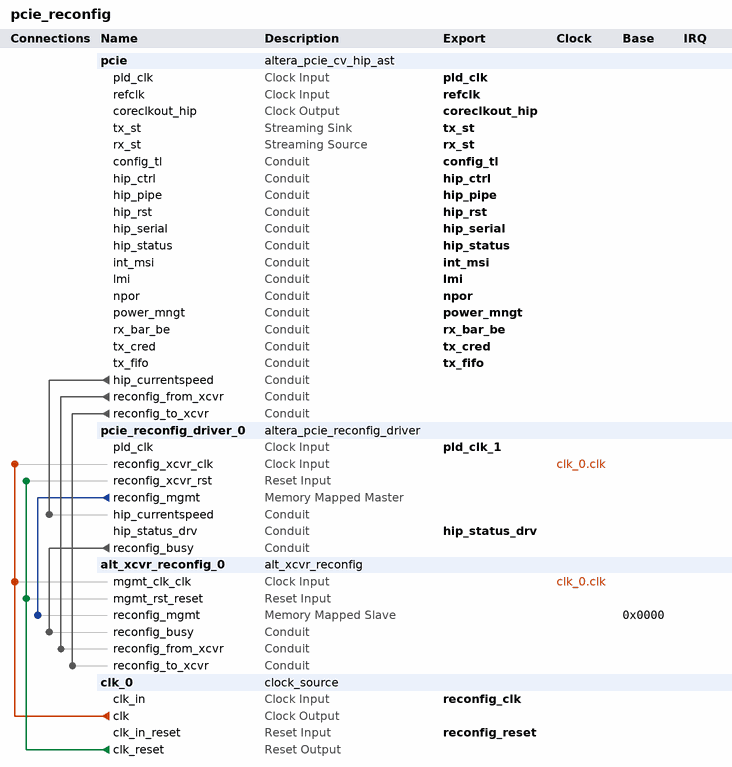
[diagram p0: system contents]
# Platform Designer (Qsys) system pcie_reconfig, Cyclone V 5CGXFC7D7F31C8
# Parameters at their usual value, and those the tool derives, are not listed.
package require -exact qsys 16.1
create_system pcie_reconfig
set_project_property DEVICE_FAMILY {Cyclone V}
set_project_property DEVICE 5CGXFC7D7F31C8

add_instance pcie altera_pcie_cv_hip_ast 16.1
set_instance_parameter_value pcie ACDS_VERSION_HWTCL 15.0
set_instance_parameter_value pcie advanced_default_parameter_override 0
set_instance_parameter_value pcie altpcie_avmm_hwtcl 0
set_instance_parameter_value pcie ast_width_hwtcl {Avalon-ST 64-bit}
set_instance_parameter_value pcie bar0_size_mask_0_hwtcl 7
set_instance_parameter_value pcie bar0_size_mask_1_hwtcl 28
set_instance_parameter_value pcie bar0_size_mask_2_hwtcl 28
set_instance_parameter_value pcie bar0_size_mask_3_hwtcl 28
set_instance_parameter_value pcie bar0_size_mask_4_hwtcl 28
set_instance_parameter_value pcie bar0_size_mask_5_hwtcl 28
set_instance_parameter_value pcie bar0_size_mask_6_hwtcl 28
set_instance_parameter_value pcie bar0_size_mask_7_hwtcl 28
set_instance_parameter_value pcie bar0_type_0_hwtcl 1
set_instance_parameter_value pcie bar0_type_1_hwtcl 1
set_instance_parameter_value pcie bar0_type_2_hwtcl 1
set_instance_parameter_value pcie bar0_type_3_hwtcl 1
set_instance_parameter_value pcie bar0_type_4_hwtcl 1
set_instance_parameter_value pcie bar0_type_5_hwtcl 1
set_instance_parameter_value pcie bar0_type_6_hwtcl 1
set_instance_parameter_value pcie bar0_type_7_hwtcl 1
set_instance_parameter_value pcie bar1_size_mask_0_hwtcl 0
set_instance_parameter_value pcie bar1_size_mask_1_hwtcl 0
set_instance_parameter_value pcie bar1_size_mask_2_hwtcl 0
set_instance_parameter_value pcie bar1_size_mask_3_hwtcl 0
set_instance_parameter_value pcie bar1_size_mask_4_hwtcl 0
set_instance_parameter_value pcie bar1_size_mask_5_hwtcl 0
set_instance_parameter_value pcie bar1_size_mask_6_hwtcl 0
set_instance_parameter_value pcie bar1_size_mask_7_hwtcl 0
set_instance_parameter_value pcie bar1_type_0_hwtcl 0
set_instance_parameter_value pcie bar1_type_1_hwtcl 0
set_instance_parameter_value pcie bar1_type_2_hwtcl 0
set_instance_parameter_value pcie bar1_type_3_hwtcl 0
set_instance_parameter_value pcie bar1_type_4_hwtcl 0
set_instance_parameter_value pcie bar1_type_5_hwtcl 0
set_instance_parameter_value pcie bar1_type_6_hwtcl 0
set_instance_parameter_value pcie bar1_type_7_hwtcl 0
set_instance_parameter_value pcie bar2_size_mask_0_hwtcl 0
set_instance_parameter_value pcie bar2_size_mask_1_hwtcl 0
set_instance_parameter_value pcie bar2_size_mask_2_hwtcl 0
set_instance_parameter_value pcie bar2_size_mask_3_hwtcl 0
set_instance_parameter_value pcie bar2_size_mask_4_hwtcl 0
set_instance_parameter_value pcie bar2_size_mask_5_hwtcl 0
set_instance_parameter_value pcie bar2_size_mask_6_hwtcl 0
set_instance_parameter_value pcie bar2_size_mask_7_hwtcl 0
set_instance_parameter_value pcie bar2_type_0_hwtcl 0
set_instance_parameter_value pcie bar2_type_1_hwtcl 0
set_instance_parameter_value pcie bar2_type_2_hwtcl 0
set_instance_parameter_value pcie bar2_type_3_hwtcl 0
set_instance_parameter_value pcie bar2_type_4_hwtcl 0
set_instance_parameter_value pcie bar2_type_5_hwtcl 0
set_instance_parameter_value pcie bar2_type_6_hwtcl 0
set_instance_parameter_value pcie bar2_type_7_hwtcl 0
set_instance_parameter_value pcie bar3_size_mask_0_hwtcl 0
set_instance_parameter_value pcie bar3_size_mask_1_hwtcl 0
set_instance_parameter_value pcie bar3_size_mask_2_hwtcl 0
set_instance_parameter_value pcie bar3_size_mask_3_hwtcl 0
set_instance_parameter_value pcie bar3_size_mask_4_hwtcl 0
set_instance_parameter_value pcie bar3_size_mask_5_hwtcl 0
set_instance_parameter_value pcie bar3_size_mask_6_hwtcl 0
set_instance_parameter_value pcie bar3_size_mask_7_hwtcl 0
set_instance_parameter_value pcie bar3_type_0_hwtcl 0
set_instance_parameter_value pcie bar3_type_1_hwtcl 0
set_instance_parameter_value pcie bar3_type_2_hwtcl 0
set_instance_parameter_value pcie bar3_type_3_hwtcl 0
set_instance_parameter_value pcie bar3_type_4_hwtcl 0
set_instance_parameter_value pcie bar3_type_5_hwtcl 0
set_instance_parameter_value pcie bar3_type_6_hwtcl 0
set_instance_parameter_value pcie bar3_type_7_hwtcl 0
set_instance_parameter_value pcie bar4_size_mask_0_hwtcl 0
set_instance_parameter_value pcie bar4_size_mask_1_hwtcl 0
set_instance_parameter_value pcie bar4_size_mask_2_hwtcl 0
set_instance_parameter_value pcie bar4_size_mask_3_hwtcl 0
set_instance_parameter_value pcie bar4_size_mask_4_hwtcl 0
set_instance_parameter_value pcie bar4_size_mask_5_hwtcl 0
set_instance_parameter_value pcie bar4_size_mask_6_hwtcl 0
set_instance_parameter_value pcie bar4_size_mask_7_hwtcl 0
set_instance_parameter_value pcie bar4_type_0_hwtcl 0
set_instance_parameter_value pcie bar4_type_1_hwtcl 0
set_instance_parameter_value pcie bar4_type_2_hwtcl 0
set_instance_parameter_value pcie bar4_type_3_hwtcl 0
set_instance_parameter_value pcie bar4_type_4_hwtcl 0
set_instance_parameter_value pcie bar4_type_5_hwtcl 0
set_instance_parameter_value pcie bar4_type_6_hwtcl 0
set_instance_parameter_value pcie bar4_type_7_hwtcl 0
set_instance_parameter_value pcie bar5_size_mask_0_hwtcl 0
set_instance_parameter_value pcie bar5_size_mask_1_hwtcl 0
set_instance_parameter_value pcie bar5_size_mask_2_hwtcl 0
set_instance_parameter_value pcie bar5_size_mask_3_hwtcl 0
set_instance_parameter_value pcie bar5_size_mask_4_hwtcl 0
set_instance_parameter_value pcie bar5_size_mask_5_hwtcl 0
set_instance_parameter_value pcie bar5_size_mask_6_hwtcl 0
set_instance_parameter_value pcie bar5_size_mask_7_hwtcl 0
set_instance_parameter_value pcie bar5_type_0_hwtcl 0
set_instance_parameter_value pcie bar5_type_1_hwtcl 0
set_instance_parameter_value pcie bar5_type_2_hwtcl 0
set_instance_parameter_value pcie bar5_type_3_hwtcl 0
set_instance_parameter_value pcie bar5_type_4_hwtcl 0
set_instance_parameter_value pcie bar5_type_5_hwtcl 0
set_instance_parameter_value pcie bar5_type_6_hwtcl 0
set_instance_parameter_value pcie bar5_type_7_hwtcl 0
set_instance_parameter_value pcie bridge_port_ssid_support_0_hwtcl false
set_instance_parameter_value pcie bridge_port_ssid_support_1_hwtcl false
set_instance_parameter_value pcie bridge_port_ssid_support_2_hwtcl false
set_instance_parameter_value pcie bridge_port_ssid_support_3_hwtcl false
set_instance_parameter_value pcie bridge_port_ssid_support_4_hwtcl false
set_instance_parameter_value pcie bridge_port_ssid_support_5_hwtcl false
set_instance_parameter_value pcie bridge_port_ssid_support_6_hwtcl false
set_instance_parameter_value pcie bridge_port_ssid_support_7_hwtcl false
set_instance_parameter_value pcie bridge_port_vga_enable_0_hwtcl false
set_instance_parameter_value pcie bridge_port_vga_enable_1_hwtcl false
set_instance_parameter_value pcie bridge_port_vga_enable_2_hwtcl false
set_instance_parameter_value pcie bridge_port_vga_enable_3_hwtcl false
set_instance_parameter_value pcie bridge_port_vga_enable_4_hwtcl false
set_instance_parameter_value pcie bridge_port_vga_enable_5_hwtcl false
set_instance_parameter_value pcie bridge_port_vga_enable_6_hwtcl false
set_instance_parameter_value pcie bridge_port_vga_enable_7_hwtcl false
set_instance_parameter_value pcie cdc_dummy_insert_limit_advanced_default_hwtcl 11
set_instance_parameter_value pcie class_code_0_hwtcl 16711680
set_instance_parameter_value pcie class_code_1_hwtcl 0
set_instance_parameter_value pcie class_code_2_hwtcl 0
set_instance_parameter_value pcie class_code_3_hwtcl 0
set_instance_parameter_value pcie class_code_4_hwtcl 0
set_instance_parameter_value pcie class_code_5_hwtcl 0
set_instance_parameter_value pcie class_code_6_hwtcl 0
set_instance_parameter_value pcie class_code_7_hwtcl 0
set_instance_parameter_value pcie completion_timeout_hwtcl ABCD
set_instance_parameter_value pcie d0_pme_advanced_default_hwtcl false
set_instance_parameter_value pcie d1_pme_advanced_default_hwtcl false
set_instance_parameter_value pcie d1_support_advanced_default_hwtcl false
set_instance_parameter_value pcie d2_pme_advanced_default_hwtcl false
set_instance_parameter_value pcie d2_support_advanced_default_hwtcl false
set_instance_parameter_value pcie d3_cold_pme_advanced_default_hwtcl false
set_instance_parameter_value pcie d3_hot_pme_advanced_default_hwtcl false
set_instance_parameter_value pcie deemphasis_enable_advanced_default_hwtcl false
set_instance_parameter_value pcie device_id_0_hwtcl 60395
set_instance_parameter_value pcie device_id_1_hwtcl 1
set_instance_parameter_value pcie device_id_2_hwtcl 1
set_instance_parameter_value pcie device_id_3_hwtcl 1
set_instance_parameter_value pcie device_id_4_hwtcl 1
set_instance_parameter_value pcie device_id_5_hwtcl 1
set_instance_parameter_value pcie device_id_6_hwtcl 1
set_instance_parameter_value pcie device_id_7_hwtcl 1
set_instance_parameter_value pcie device_number_advanced_default_hwtcl 0
set_instance_parameter_value pcie diffclock_nfts_count_advanced_default_hwtcl 255
set_instance_parameter_value pcie disable_link_x2_support_advanced_default_hwtcl false
set_instance_parameter_value pcie disable_snoop_packet_0_hwtcl false
set_instance_parameter_value pcie disable_snoop_packet_1_hwtcl false
set_instance_parameter_value pcie disable_snoop_packet_2_hwtcl false
set_instance_parameter_value pcie disable_snoop_packet_3_hwtcl false
set_instance_parameter_value pcie disable_snoop_packet_4_hwtcl false
set_instance_parameter_value pcie disable_snoop_packet_5_hwtcl false
set_instance_parameter_value pcie disable_snoop_packet_6_hwtcl false
set_instance_parameter_value pcie disable_snoop_packet_7_hwtcl false
set_instance_parameter_value pcie dll_active_report_support_0_hwtcl 0
set_instance_parameter_value pcie dll_active_report_support_1_hwtcl 0
set_instance_parameter_value pcie dll_active_report_support_2_hwtcl 0
set_instance_parameter_value pcie dll_active_report_support_3_hwtcl 0
set_instance_parameter_value pcie dll_active_report_support_4_hwtcl 0
set_instance_parameter_value pcie dll_active_report_support_5_hwtcl 0
set_instance_parameter_value pcie dll_active_report_support_6_hwtcl 0
set_instance_parameter_value pcie dll_active_report_support_7_hwtcl 0
set_instance_parameter_value pcie ecrc_check_capable_hwtcl 0
set_instance_parameter_value pcie ecrc_gen_capable_hwtcl 0
set_instance_parameter_value pcie ei_delay_powerdown_count_advanced_default_hwtcl 10
set_instance_parameter_value pcie eie_before_nfts_count_advanced_default_hwtcl 4
set_instance_parameter_value pcie enable_completion_timeout_disable_hwtcl 1
set_instance_parameter_value pcie enable_function_msix_support_0_hwtcl 0
set_instance_parameter_value pcie enable_function_msix_support_1_hwtcl 0
set_instance_parameter_value pcie enable_function_msix_support_2_hwtcl 0
set_instance_parameter_value pcie enable_function_msix_support_3_hwtcl 0
set_instance_parameter_value pcie enable_function_msix_support_4_hwtcl 0
set_instance_parameter_value pcie enable_function_msix_support_5_hwtcl 0
set_instance_parameter_value pcie enable_function_msix_support_6_hwtcl 0
set_instance_parameter_value pcie enable_function_msix_support_7_hwtcl 0
set_instance_parameter_value pcie enable_l1_aspm_advanced_default_hwtcl false
set_instance_parameter_value pcie enable_rx_buffer_checking_advanced_default_hwtcl false
set_instance_parameter_value pcie enable_slot_register_hwtcl 0
set_instance_parameter_value pcie endpoint_l0_latency_hwtcl 0
set_instance_parameter_value pcie endpoint_l1_latency_hwtcl 0
set_instance_parameter_value pcie expansion_base_address_register_0_hwtcl 0
set_instance_parameter_value pcie expansion_base_address_register_1_hwtcl 0
set_instance_parameter_value pcie expansion_base_address_register_2_hwtcl 0
set_instance_parameter_value pcie expansion_base_address_register_3_hwtcl 0
set_instance_parameter_value pcie expansion_base_address_register_4_hwtcl 0
set_instance_parameter_value pcie expansion_base_address_register_5_hwtcl 0
set_instance_parameter_value pcie expansion_base_address_register_6_hwtcl 0
set_instance_parameter_value pcie expansion_base_address_register_7_hwtcl 0
set_instance_parameter_value pcie extend_tag_field_hwtcl 32
set_instance_parameter_value pcie fc_init_timer_advanced_default_hwtcl 1024
set_instance_parameter_value pcie flow_control_timeout_count_advanced_default_hwtcl 200
set_instance_parameter_value pcie flow_control_update_count_advanced_default_hwtcl 30
set_instance_parameter_value pcie flr_capability_0_hwtcl 0
set_instance_parameter_value pcie flr_capability_1_hwtcl 0
set_instance_parameter_value pcie flr_capability_2_hwtcl 0
set_instance_parameter_value pcie flr_capability_3_hwtcl 0
set_instance_parameter_value pcie flr_capability_4_hwtcl 0
set_instance_parameter_value pcie flr_capability_5_hwtcl 0
set_instance_parameter_value pcie flr_capability_6_hwtcl 0
set_instance_parameter_value pcie flr_capability_7_hwtcl 0
set_instance_parameter_value pcie force_hrc 0
set_instance_parameter_value pcie force_src 0
set_instance_parameter_value pcie gen12_lane_rate_mode_hwtcl {Gen1 (2.5 Gbps)}
set_instance_parameter_value pcie gen2_diffclock_nfts_count_advanced_default_hwtcl 255
set_instance_parameter_value pcie gen2_sameclock_nfts_count_advanced_default_hwtcl 255
set_instance_parameter_value pcie hip_reconfig_hwtcl 0
set_instance_parameter_value pcie hot_plug_support_advanced_default_hwtcl 0
set_instance_parameter_value pcie in_cvp_mode_hwtcl 0
set_instance_parameter_value pcie indicator_advanced_default_hwtcl 0
set_instance_parameter_value pcie interrupt_pin_0_hwtcl inta
set_instance_parameter_value pcie interrupt_pin_1_hwtcl inta
set_instance_parameter_value pcie interrupt_pin_2_hwtcl inta
set_instance_parameter_value pcie interrupt_pin_3_hwtcl inta
set_instance_parameter_value pcie interrupt_pin_4_hwtcl inta
set_instance_parameter_value pcie interrupt_pin_5_hwtcl inta
set_instance_parameter_value pcie interrupt_pin_6_hwtcl inta
set_instance_parameter_value pcie interrupt_pin_7_hwtcl inta
set_instance_parameter_value pcie io_window_addr_width_hwtcl 0
set_instance_parameter_value pcie l01_entry_latency_advanced_default_hwtcl 31
set_instance_parameter_value pcie l0_exit_latency_diffclock_advanced_default_hwtcl 6
set_instance_parameter_value pcie l0_exit_latency_sameclock_advanced_default_hwtcl 6
set_instance_parameter_value pcie l1_exit_latency_diffclock_advanced_default_hwtcl 0
set_instance_parameter_value pcie l1_exit_latency_sameclock_advanced_default_hwtcl 0
set_instance_parameter_value pcie l2_async_logic_advanced_default_hwtcl disable
set_instance_parameter_value pcie lane_mask_hwtcl x4
set_instance_parameter_value pcie low_priority_vc_advanced_default_hwtcl single_vc
set_instance_parameter_value pcie max_payload_size_hwtcl 128
set_instance_parameter_value pcie maximum_current_0_hwtcl 0
set_instance_parameter_value pcie maximum_current_1_hwtcl 0
set_instance_parameter_value pcie maximum_current_2_hwtcl 0
set_instance_parameter_value pcie maximum_current_3_hwtcl 0
set_instance_parameter_value pcie maximum_current_4_hwtcl 0
set_instance_parameter_value pcie maximum_current_5_hwtcl 0
set_instance_parameter_value pcie maximum_current_6_hwtcl 0
set_instance_parameter_value pcie maximum_current_7_hwtcl 0
set_instance_parameter_value pcie msi_64bit_addressing_capable_0_hwtcl true
set_instance_parameter_value pcie msi_64bit_addressing_capable_1_hwtcl true
set_instance_parameter_value pcie msi_64bit_addressing_capable_2_hwtcl true
set_instance_parameter_value pcie msi_64bit_addressing_capable_3_hwtcl true
set_instance_parameter_value pcie msi_64bit_addressing_capable_4_hwtcl true
set_instance_parameter_value pcie msi_64bit_addressing_capable_5_hwtcl true
set_instance_parameter_value pcie msi_64bit_addressing_capable_6_hwtcl true
set_instance_parameter_value pcie msi_64bit_addressing_capable_7_hwtcl true
set_instance_parameter_value pcie msi_masking_capable_0_hwtcl false
set_instance_parameter_value pcie msi_masking_capable_1_hwtcl false
set_instance_parameter_value pcie msi_masking_capable_2_hwtcl false
set_instance_parameter_value pcie msi_masking_capable_3_hwtcl false
set_instance_parameter_value pcie msi_masking_capable_4_hwtcl false
set_instance_parameter_value pcie msi_masking_capable_5_hwtcl false
set_instance_parameter_value pcie msi_masking_capable_6_hwtcl false
set_instance_parameter_value pcie msi_masking_capable_7_hwtcl false
set_instance_parameter_value pcie msi_multi_message_capable_0_hwtcl 1
set_instance_parameter_value pcie msi_multi_message_capable_1_hwtcl 4
set_instance_parameter_value pcie msi_multi_message_capable_2_hwtcl 4
set_instance_parameter_value pcie msi_multi_message_capable_3_hwtcl 4
set_instance_parameter_value pcie msi_multi_message_capable_4_hwtcl 4
set_instance_parameter_value pcie msi_multi_message_capable_5_hwtcl 4
set_instance_parameter_value pcie msi_multi_message_capable_6_hwtcl 4
set_instance_parameter_value pcie msi_multi_message_capable_7_hwtcl 4
set_instance_parameter_value pcie msi_support_0_hwtcl true
set_instance_parameter_value pcie msi_support_1_hwtcl true
set_instance_parameter_value pcie msi_support_2_hwtcl true
set_instance_parameter_value pcie msi_support_3_hwtcl true
set_instance_parameter_value pcie msi_support_4_hwtcl true
set_instance_parameter_value pcie msi_support_5_hwtcl true
set_instance_parameter_value pcie msi_support_6_hwtcl true
set_instance_parameter_value pcie msi_support_7_hwtcl true
set_instance_parameter_value pcie msix_pba_bir_0_hwtcl 0
set_instance_parameter_value pcie msix_pba_bir_1_hwtcl 0
set_instance_parameter_value pcie msix_pba_bir_2_hwtcl 0
set_instance_parameter_value pcie msix_pba_bir_3_hwtcl 0
set_instance_parameter_value pcie msix_pba_bir_4_hwtcl 0
set_instance_parameter_value pcie msix_pba_bir_5_hwtcl 0
set_instance_parameter_value pcie msix_pba_bir_6_hwtcl 0
set_instance_parameter_value pcie msix_pba_bir_7_hwtcl 0
set_instance_parameter_value pcie msix_pba_offset_0_hwtcl 0
set_instance_parameter_value pcie msix_pba_offset_1_hwtcl 0
set_instance_parameter_value pcie msix_pba_offset_2_hwtcl 0
set_instance_parameter_value pcie msix_pba_offset_3_hwtcl 0
set_instance_parameter_value pcie msix_pba_offset_4_hwtcl 0
set_instance_parameter_value pcie msix_pba_offset_5_hwtcl 0
set_instance_parameter_value pcie msix_pba_offset_6_hwtcl 0
set_instance_parameter_value pcie msix_pba_offset_7_hwtcl 0
set_instance_parameter_value pcie msix_table_bir_0_hwtcl 0
set_instance_parameter_value pcie msix_table_bir_1_hwtcl 0
set_instance_parameter_value pcie msix_table_bir_2_hwtcl 0
set_instance_parameter_value pcie msix_table_bir_3_hwtcl 0
set_instance_parameter_value pcie msix_table_bir_4_hwtcl 0
set_instance_parameter_value pcie msix_table_bir_5_hwtcl 0
set_instance_parameter_value pcie msix_table_bir_6_hwtcl 0
set_instance_parameter_value pcie msix_table_bir_7_hwtcl 0
set_instance_parameter_value pcie msix_table_offset_0_hwtcl 0
set_instance_parameter_value pcie msix_table_offset_1_hwtcl 0
set_instance_parameter_value pcie msix_table_offset_2_hwtcl 0
set_instance_parameter_value pcie msix_table_offset_3_hwtcl 0
set_instance_parameter_value pcie msix_table_offset_4_hwtcl 0
set_instance_parameter_value pcie msix_table_offset_5_hwtcl 0
set_instance_parameter_value pcie msix_table_offset_6_hwtcl 0
set_instance_parameter_value pcie msix_table_offset_7_hwtcl 0
set_instance_parameter_value pcie msix_table_size_0_hwtcl 0
set_instance_parameter_value pcie msix_table_size_1_hwtcl 0
set_instance_parameter_value pcie msix_table_size_2_hwtcl 0
set_instance_parameter_value pcie msix_table_size_3_hwtcl 0
set_instance_parameter_value pcie msix_table_size_4_hwtcl 0
set_instance_parameter_value pcie msix_table_size_5_hwtcl 0
set_instance_parameter_value pcie msix_table_size_6_hwtcl 0
set_instance_parameter_value pcie msix_table_size_7_hwtcl 0
set_instance_parameter_value pcie no_command_completed_advanced_default_hwtcl false
set_instance_parameter_value pcie no_soft_reset_advanced_default_hwtcl false
set_instance_parameter_value pcie num_of_func_hwtcl 1
set_instance_parameter_value pcie override_rxbuffer_cred_preset 0
set_instance_parameter_value pcie override_tbpartner_driver_setting_hwtcl 0
set_instance_parameter_value pcie pcie_qsys 1
set_instance_parameter_value pcie pcie_spec_version_hwtcl 2.1
set_instance_parameter_value pcie pclk_out_sel_advanced_default_hwtcl pclk
set_instance_parameter_value pcie pipex1_debug_sel_advanced_default_hwtcl disable
set_instance_parameter_value pcie pll_refclk_freq_hwtcl {100 MHz}
set_instance_parameter_value pcie port_link_number_hwtcl 1
set_instance_parameter_value pcie porttype_func_hwtcl {Native endpoint}
set_instance_parameter_value pcie prefetchable_mem_window_addr_width_hwtcl 0
set_instance_parameter_value pcie register_pipe_signals_advanced_default_hwtcl true
set_instance_parameter_value pcie reserved_debug_advanced_default_hwtcl 0
set_instance_parameter_value pcie retry_buffer_last_active_address_advanced_default_hwtcl 255
set_instance_parameter_value pcie revision_id_0_hwtcl 1
set_instance_parameter_value pcie revision_id_1_hwtcl 1
set_instance_parameter_value pcie revision_id_2_hwtcl 1
set_instance_parameter_value pcie revision_id_3_hwtcl 1
set_instance_parameter_value pcie revision_id_4_hwtcl 1
set_instance_parameter_value pcie revision_id_5_hwtcl 1
set_instance_parameter_value pcie revision_id_6_hwtcl 1
set_instance_parameter_value pcie revision_id_7_hwtcl 1
set_instance_parameter_value pcie rpre_emph_a_val_hwtcl 11
set_instance_parameter_value pcie rpre_emph_b_val_hwtcl 0
set_instance_parameter_value pcie rpre_emph_c_val_hwtcl 22
set_instance_parameter_value pcie rpre_emph_d_val_hwtcl 12
set_instance_parameter_value pcie rpre_emph_e_val_hwtcl 21
set_instance_parameter_value pcie rvod_sel_a_val_hwtcl 50
set_instance_parameter_value pcie rvod_sel_b_val_hwtcl 34
set_instance_parameter_value pcie rvod_sel_c_val_hwtcl 50
set_instance_parameter_value pcie rvod_sel_d_val_hwtcl 50
set_instance_parameter_value pcie rvod_sel_e_val_hwtcl 9
set_instance_parameter_value pcie rx_cdc_almost_full_advanced_default_hwtcl 12
set_instance_parameter_value pcie rx_l0s_count_idl_advanced_default_hwtcl 0
set_instance_parameter_value pcie rxbuffer_rxreq_hwtcl Balanced
set_instance_parameter_value pcie sameclock_nfts_count_advanced_default_hwtcl 255
set_instance_parameter_value pcie serial_sim_hwtcl 0
set_instance_parameter_value pcie set_l0s_hwtcl 0
set_instance_parameter_value pcie set_pld_clk_x1_625MHz_hwtcl 0
set_instance_parameter_value pcie skp_os_schedule_count_advanced_default_hwtcl 0
set_instance_parameter_value pcie slot_number_hwtcl 0
set_instance_parameter_value pcie slot_power_limit_hwtcl 0
set_instance_parameter_value pcie slot_power_scale_hwtcl 0
set_instance_parameter_value pcie slotclkcfg_hwtcl 1
set_instance_parameter_value pcie ssid_0_hwtcl 0
set_instance_parameter_value pcie ssid_1_hwtcl 0
set_instance_parameter_value pcie ssid_2_hwtcl 0
set_instance_parameter_value pcie ssid_3_hwtcl 0
set_instance_parameter_value pcie ssid_4_hwtcl 0
set_instance_parameter_value pcie ssid_5_hwtcl 0
set_instance_parameter_value pcie ssid_6_hwtcl 0
set_instance_parameter_value pcie ssid_7_hwtcl 0
set_instance_parameter_value pcie ssvid_0_hwtcl 0
set_instance_parameter_value pcie ssvid_1_hwtcl 0
set_instance_parameter_value pcie ssvid_2_hwtcl 0
set_instance_parameter_value pcie ssvid_3_hwtcl 0
set_instance_parameter_value pcie ssvid_4_hwtcl 0
set_instance_parameter_value pcie ssvid_5_hwtcl 0
set_instance_parameter_value pcie ssvid_6_hwtcl 0
set_instance_parameter_value pcie ssvid_7_hwtcl 0
set_instance_parameter_value pcie subsystem_device_id_0_hwtcl 60395
set_instance_parameter_value pcie subsystem_device_id_1_hwtcl 0
set_instance_parameter_value pcie subsystem_device_id_2_hwtcl 0
set_instance_parameter_value pcie subsystem_device_id_3_hwtcl 0
set_instance_parameter_value pcie subsystem_device_id_4_hwtcl 0
set_instance_parameter_value pcie subsystem_device_id_5_hwtcl 0
set_instance_parameter_value pcie subsystem_device_id_6_hwtcl 0
set_instance_parameter_value pcie subsystem_device_id_7_hwtcl 0
set_instance_parameter_value pcie subsystem_vendor_id_0_hwtcl 4466
set_instance_parameter_value pcie subsystem_vendor_id_1_hwtcl 0
set_instance_parameter_value pcie subsystem_vendor_id_2_hwtcl 0
set_instance_parameter_value pcie subsystem_vendor_id_3_hwtcl 0
set_instance_parameter_value pcie subsystem_vendor_id_4_hwtcl 0
set_instance_parameter_value pcie subsystem_vendor_id_5_hwtcl 0
set_instance_parameter_value pcie subsystem_vendor_id_6_hwtcl 0
set_instance_parameter_value pcie subsystem_vendor_id_7_hwtcl 0
set_instance_parameter_value pcie surprise_down_error_support_0_hwtcl 0
set_instance_parameter_value pcie surprise_down_error_support_1_hwtcl 0
set_instance_parameter_value pcie surprise_down_error_support_2_hwtcl 0
set_instance_parameter_value pcie surprise_down_error_support_3_hwtcl 0
set_instance_parameter_value pcie surprise_down_error_support_4_hwtcl 0
set_instance_parameter_value pcie surprise_down_error_support_5_hwtcl 0
set_instance_parameter_value pcie surprise_down_error_support_6_hwtcl 0
set_instance_parameter_value pcie surprise_down_error_support_7_hwtcl 0
set_instance_parameter_value pcie tx_cdc_almost_empty_advanced_default_hwtcl 5
set_instance_parameter_value pcie tx_cdc_almost_full_advanced_default_hwtcl 11
set_instance_parameter_value pcie use_aer_hwtcl 0
set_instance_parameter_value pcie use_crc_forwarding_hwtcl 0
set_instance_parameter_value pcie use_rx_st_be_hwtcl 0
set_instance_parameter_value pcie use_tl_cfg_sync_advanced_default_hwtcl 1
set_instance_parameter_value pcie user_id_hwtcl 0
set_instance_parameter_value pcie vc0_clk_enable_advanced_default_hwtcl true
set_instance_parameter_value pcie vendor_id_0_hwtcl 4466
set_instance_parameter_value pcie vendor_id_1_hwtcl 0
set_instance_parameter_value pcie vendor_id_2_hwtcl 0
set_instance_parameter_value pcie vendor_id_3_hwtcl 0
set_instance_parameter_value pcie vendor_id_4_hwtcl 0
set_instance_parameter_value pcie vendor_id_5_hwtcl 0
set_instance_parameter_value pcie vendor_id_6_hwtcl 0
set_instance_parameter_value pcie vendor_id_7_hwtcl 0
set_instance_parameter_value pcie vsec_id_hwtcl 4466
set_instance_parameter_value pcie vsec_rev_hwtcl 0

add_instance pcie_reconfig_driver_0 altera_pcie_reconfig_driver 16.1
set_instance_parameter_value pcie_reconfig_driver_0 gen123_lane_rate_mode_hwtcl {Gen1 (2.5 Gbps)}
set_instance_parameter_value pcie_reconfig_driver_0 number_of_reconfig_interfaces 5

add_instance alt_xcvr_reconfig_0 alt_xcvr_reconfig 16.1
set_instance_parameter_value alt_xcvr_reconfig_0 device_family {Cyclone V}
set_instance_parameter_value alt_xcvr_reconfig_0 enable_adce 0
set_instance_parameter_value alt_xcvr_reconfig_0 enable_analog 0
set_instance_parameter_value alt_xcvr_reconfig_0 number_of_reconfig_interfaces 5

add_instance clk_0 clock_source 16.1
set_instance_parameter_value clk_0 clockFrequency 100000000

# connections
add_connection clk_0.clk alt_xcvr_reconfig_0.mgmt_clk_clk clock
add_connection clk_0.clk pcie_reconfig_driver_0.reconfig_xcvr_clk clock
add_connection clk_0.clk_reset alt_xcvr_reconfig_0.mgmt_rst_reset reset
add_connection clk_0.clk_reset pcie_reconfig_driver_0.reconfig_xcvr_rst reset
add_connection pcie_reconfig_driver_0.reconfig_mgmt alt_xcvr_reconfig_0.reconfig_mgmt avalon
set_connection_parameter_value pcie_reconfig_driver_0.reconfig_mgmt/alt_xcvr_reconfig_0.reconfig_mgmt baseAddress 0x0000
add_connection pcie.hip_currentspeed pcie_reconfig_driver_0.hip_currentspeed conduit
add_connection pcie.reconfig_from_xcvr alt_xcvr_reconfig_0.reconfig_from_xcvr conduit
add_connection pcie.reconfig_to_xcvr alt_xcvr_reconfig_0.reconfig_to_xcvr conduit
add_connection pcie_reconfig_driver_0.reconfig_busy alt_xcvr_reconfig_0.reconfig_busy conduit

# exported interfaces
add_interface config_tl conduit end
set_interface_property config_tl EXPORT_OF pcie.config_tl
add_interface coreclkout_hip clock source
set_interface_property coreclkout_hip EXPORT_OF pcie.coreclkout_hip
add_interface hip_ctrl conduit end
set_interface_property hip_ctrl EXPORT_OF pcie.hip_ctrl
add_interface hip_pipe conduit end
set_interface_property hip_pipe EXPORT_OF pcie.hip_pipe
add_interface hip_rst conduit end
set_interface_property hip_rst EXPORT_OF pcie.hip_rst
add_interface hip_serial conduit end
set_interface_property hip_serial EXPORT_OF pcie.hip_serial
add_interface hip_status conduit end
set_interface_property hip_status EXPORT_OF pcie.hip_status
add_interface hip_status_drv conduit end
set_interface_property hip_status_drv EXPORT_OF pcie_reconfig_driver_0.hip_status_drv
add_interface int_msi conduit end
set_interface_property int_msi EXPORT_OF pcie.int_msi
add_interface lmi conduit end
set_interface_property lmi EXPORT_OF pcie.lmi
add_interface npor conduit end
set_interface_property npor EXPORT_OF pcie.npor
add_interface pld_clk clock sink
set_interface_property pld_clk EXPORT_OF pcie.pld_clk
add_interface pld_clk_1 clock sink
set_interface_property pld_clk_1 EXPORT_OF pcie_reconfig_driver_0.pld_clk
add_interface power_mngt conduit end
set_interface_property power_mngt EXPORT_OF pcie.power_mngt
add_interface reconfig_clk clock sink
set_interface_property reconfig_clk EXPORT_OF clk_0.clk_in
add_interface reconfig_reset reset sink
set_interface_property reconfig_reset EXPORT_OF clk_0.clk_in_reset
add_interface refclk clock sink
set_interface_property refclk EXPORT_OF pcie.refclk
add_interface rx_bar_be conduit end
set_interface_property rx_bar_be EXPORT_OF pcie.rx_bar_be
add_interface rx_st avalon_streaming source
set_interface_property rx_st EXPORT_OF pcie.rx_st
add_interface tx_cred conduit end
set_interface_property tx_cred EXPORT_OF pcie.tx_cred
add_interface tx_fifo conduit end
set_interface_property tx_fifo EXPORT_OF pcie.tx_fifo
add_interface tx_st avalon_streaming sink
set_interface_property tx_st EXPORT_OF pcie.tx_st

set_interconnect_requirement {$system} qsys_mm.clockCrossingAdapter HANDSHAKE
set_interconnect_requirement {$system} qsys_mm.maxAdditionalLatency 0

save_system pcie_reconfig.qsys
